# EAGLE schematic contactor (EAGLE 9.3.1)
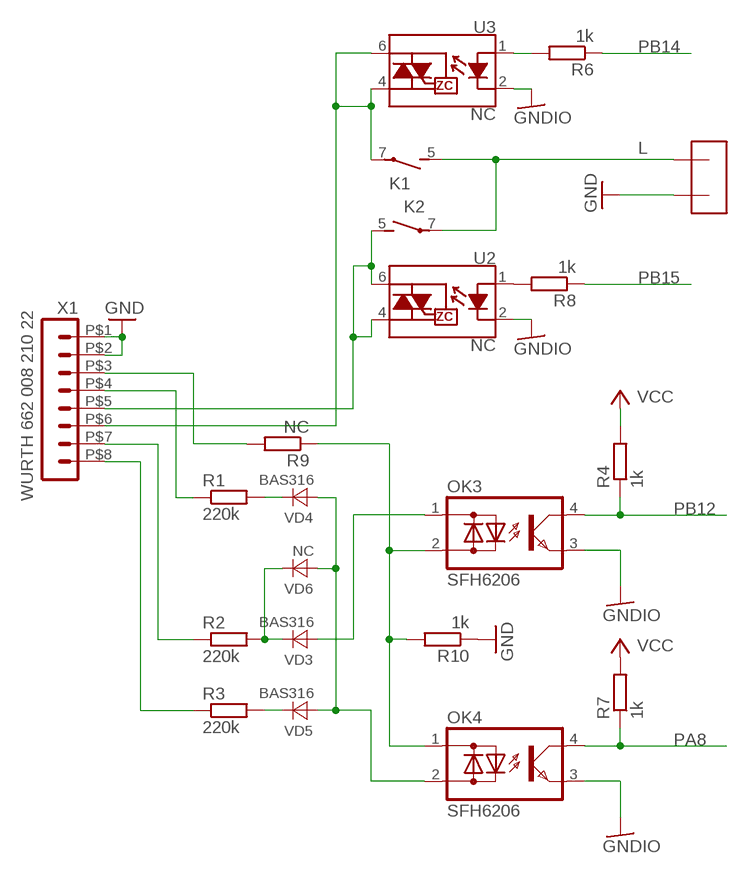
[diagram p0: schematic, sheet 1]

## Parts
K1  G6D-1A-ASI5VDC  [G6D]
K2  NC  G6D-1A-ASI5VDC  [G6D]
OK3  SFH6206  [DIL4-SMD]
OK4  SFH6206  [DIL4-SMD]
R1  220k  R-EU_R1210  [R1210]
R2  220k  R-EU_R1210  [R1210]
R3  220k  R-EU_R1210  [R1210]
R4  1k  R-EU_R0805  [R0805]
R6  1k  R-EU_R0805  [R0805]
R7  1k  R-EU_R0805  [R0805]
R8  1k  R-EU_R0805  [R0805]
R9  NC  R-EU_R0805  [R0805]
R10  1k  R-EU_R0805  [R0805]
U2  NC  TRIAC_OPTOCOUPLER-MOC3063SM  [DIP8SMD]
U3  NC  TRIAC_OPTOCOUPLER-MOC3063SM  [DIP8SMD]
U$6  2 PIN STRIP M  ISOLATED_2P  [STRIP_NOMIDDLE]
VD3  BAS316  DIODE-STANDARD-SOD323  [SOD323]
VD4  BAS316  DIODE-STANDARD-SOD323  [SOD323]
VD5  BAS316  DIODE-STANDARD-SOD323  [SOD323]
VD6  NC  DIODE-STANDARD-SOD323  [SOD323]
X1  WURTH 662 008 210 22  HEADER_POS8_43045-0800  [43045-0800]

## Nets
GND: R10.1 U$6.P$2 X1.P$1 X1.P$2
GNDIO: OK3.3(E) OK4.3(E) U2.2(K) U3.2(K)
L: K1.5(2:S) K2.7(2:P) U$6.P$1
N$6: OK3.2(AC2) OK4.1(AC1) R9.1 R10.2
N$8: R1.2 VD4.C
N$9: R3.2 VD5.C
N$10: R9.2 X1.P$3
N$11: OK4.2(AC2) VD4.A VD5.A VD6.A
N$12: R1.1 X1.P$4
N$13: R2.2 VD3.C VD6.C
N$14: R2.1 X1.P$7
N$15: OK3.1(AC1) VD3.A
N$16: R3.1 X1.P$8
N$19: K2.5(2:S) U2.4(T2) U2.6(T1) X1.P$5
N$20: K1.7(2:P) U3.4(T2) U3.6(T1) X1.P$6
N$21: R8.2 U2.1(A)
N$22: R6.2 U3.1(A)
PA8: OK4.4(C) R7.1
PB12: OK3.4(C) R4.1
PB14: R6.1
PB15: R8.1
VCC: R4.2 R7.2
Unconnected: K1.1 K1.13 K2.1 K2.13

## Library data of the parts
K1 K2 = mastrogippo:G6D?*: OMRON Slim, Miniature PCB Relay 17.5 × 6.5 × 12.5 mm with Socked Source: http://ecb.omron.com.sg/pdf/relay/power/G6D.pdf; OC_FARNELL: 9812660; OC_NEWARK: unknown
OK3 OK4 = optocoupler:SFH620: Optocoupler, Phototransistor Output, AC Input Source: http://www.vishay.com/docs/83675/sfh620.pdf; MF: VISHAY/TELEFUNKEN; MPN: SFH6206-3; OC_FARNELL: 1469585; OC_NEWARK: 58K2214
R1-R4 R6-R10 = rcl:R-EU_: RESISTOR, European symbol; SPICEPREFIX: R
U2 U3 = SparkFun-DiscreteSemi:TRIAC_OPTOCOUPLER: Zero-cross Triac Driver Optocoupler SImplifies logic control of 115/240 VAC power. Zero voltage crossing to minimize conducted and radiated line noise. Link to datasheet <http://www.mouser.com/ds/2/149/MOC3063M-196324.pdf> Emitter: VF: 1.3V IFT: 5 mA Detector: VDRM: 600V ITSM: 1A VISO: 4170V DV⁄dt: 1500V⁄µs SparkFun Products: SparkFun EL Sequencer <https://www.sparkfun.com/products/12781> SparkFun EL Escudo Dos <https://www.sparkfun.com/products/10878>; PROD_ID: IC-10683
U$6 = mastrogippo:ISOLATED_2P
VD3-VD6 = diode:DIODE-STANDARD-
X1 = con-molex-micro-fit-3_0:HEADER_POS8_?: Molex - Micro-Fit 3.0 Series connector, 3.00mm (0.118") pitch header, 8 positions.